# EasyEDA Pro project stm32-motordrive.epro, schematic Schematic1
Create Date: 2024-03-30; Page Name: P1; Project Name: motor-driver; Schematic Name: Schematic1; Update Date: 2024-03-31; Company: 嘉立创EDA; Page Size: A4; Version: V1.0
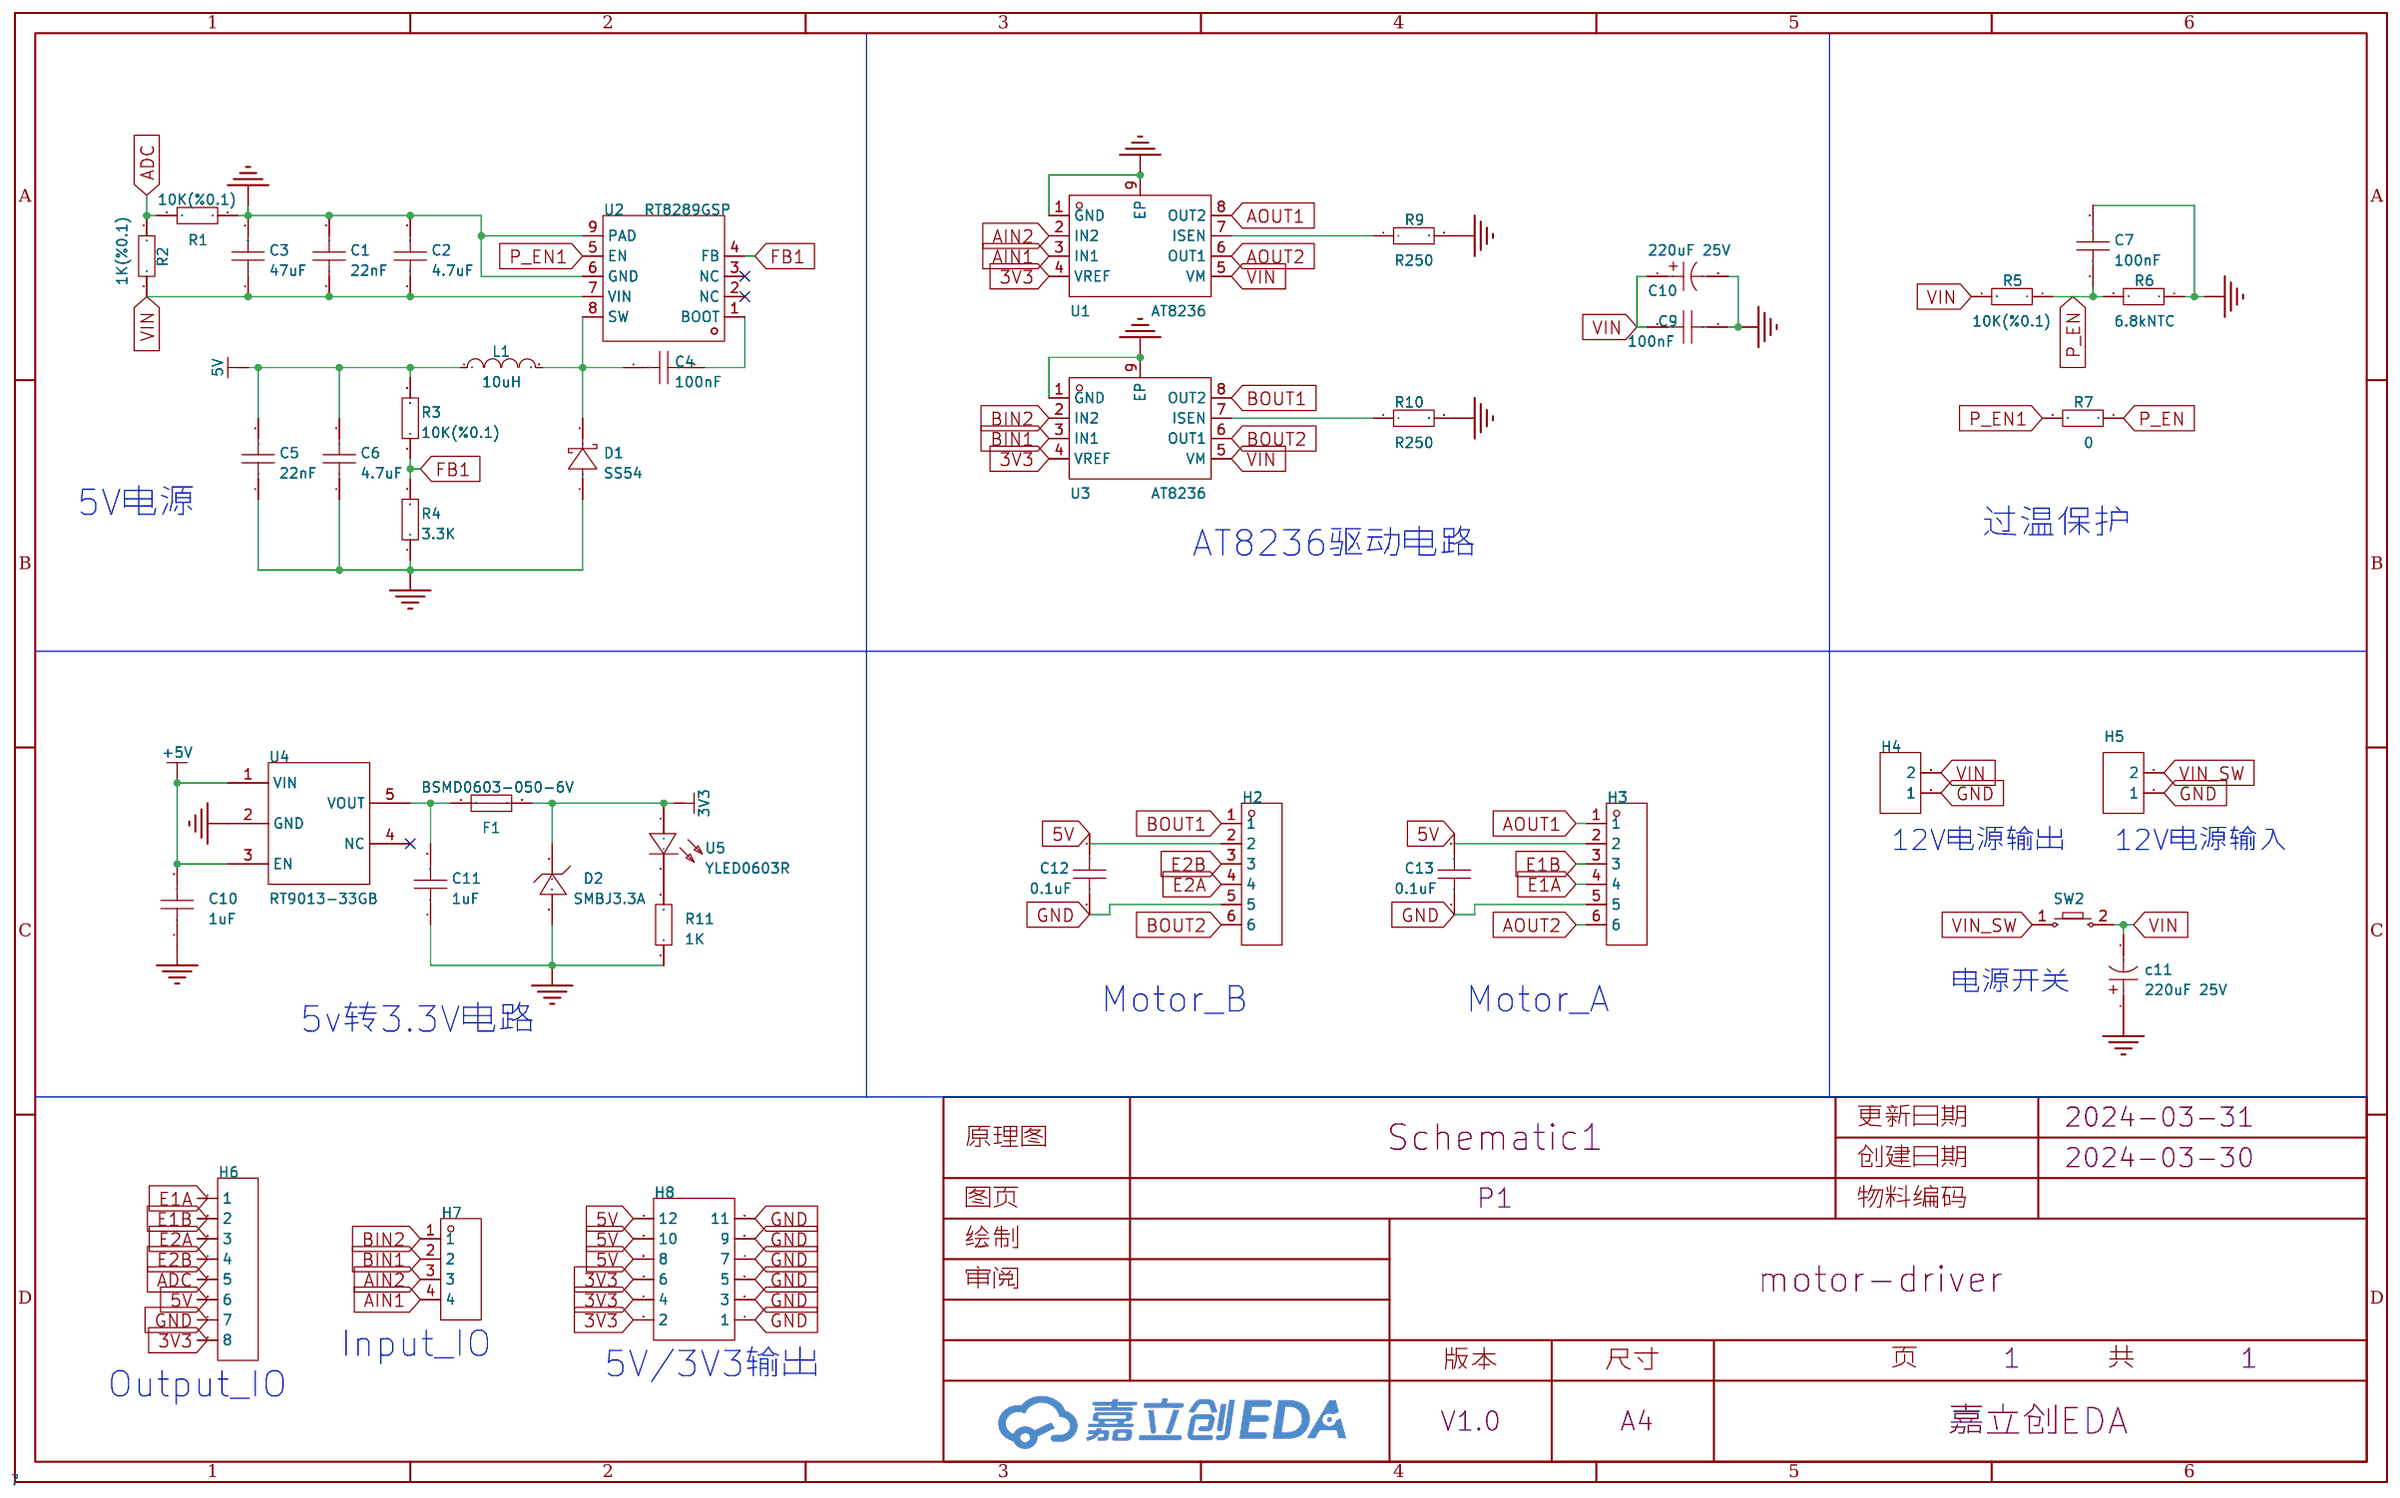
[diagram p0: schematic sheet]

## Parts
C1  22nF  [C0603]
C2  4.7uF  [C0603]
C3  47uF  [C0603]
C4  100nF  [C0603]
C5  22nF  [C0603]
C6  4.7uF  [C0603]
C7  100nF  [C0603]
C9  100nF  [C0603]
C10  220uF 25V  [CAP-SMD_BD6.3-L6.6-W6.6-LS7.2-FD]
C10#2  1uF  [C0603]
C11  1uF  [C0603]
c11  220uF 25V  [CAP-SMD_BD6.3-L6.6-W6.6-LS7.2-FD]
C12  0.1uF  [C0603]
C13  0.1uF  [C0603]
D1  SS54  [SMA_L4.3-W2.6-LS5.0-FD]
D2  SMBJ3.3A  [SMB_L4.6-W3.6-LS5.3-RD]
F1  BSMD0603-050-6V  [F0603]
H2  -  [HDR-TH_6P-P2.54-V-F]
H3  -  [HDR-TH_6P-P2.54-V-F]
H4  -  [HDR-TH_2P-P2.54-V-F]
H5  -  [HDR-TH_2P-P2.54-V-F]
H6  -  [HDR-TH_8P-P2.54-V-F-1]
H7  -  [HDR-TH_4P-P2.54-V-F]
H8  -  [HDR-TH_12P-P2.54-V-M-R2-C6-S2.54]
L1  10uH  [L0603]
R1  10K(%0.1)  [R0603]
R2  1K(%0.1)  [R0603]
R3  10K(%0.1)  [R0603]
R4  3.3K  [R0603]
R5  10K(%0.1)  [R0603]
R6  6.8kNTC  [R0603]
R7  0  [R0603]
R9  R250  [R0603]
R10  R250  [R0603]
R11  1K  [R0603]
SW2  -  [Key_SMD_3.6x6.1x2.5]
U1  AT8236  [ESOP-8_L4.9-W3.9-P1.27-LS6.0-BL-EP]
U2  RT8289GSP  [SOIC-8_L5.0-W4.0-P1.27-LS6.0-BL-EP2.0]
U3  AT8236  [ESOP-8_L4.9-W3.9-P1.27-LS6.0-BL-EP]
U4  RT9013-33GB  [SOT-23-5_L3.0-W1.7-P0.95-LS2.8-BL]
U5  YLED0603R  [LED0603-FD]

## Library data of the parts
C1-C7 C9 C10#2 C11-C13 = CAP_0603: Supplier Footprint: 0603
C10 c11 = RST220UF25V019: 容值:220uF;精度:±20%;额定电压:25V;纹波电流:165mA@120Hz;等效串联电阻:-;; LCSC Part Name: 220uF ±20% 25V; Supplier Part: C4747974; Manufacturer: KNSCHA(科尼盛); Supplier Footprint: SMD,D6.3xL7.7mm; JLCPCB Part Class: Extended Part; Datasheet: https://atta.szlcsc.com/upload/public/pdf/source/20220722/2E7F51AC9BE193B364DA1207D7353D66.pdf; Supplier: LCSC; Tolerance: ±20%; Rated Voltage: 25V; Ripple Current: 165mA@120Hz; φD: 6.3mm; L: 7.7mm; Lifetime @ Temp: 2000hrs@105℃; Operating Temperature: -40℃~+105℃
D1 = SS54_C7420369: 二极管配置:独立式;正向压降(Vf):550mV@5.0A;直流反向耐压(Vr):40V;平均整流电流(Io):5A;; LCSC Part Name: 电压:40V 电流:5A; Supplier Part: C7420369; Manufacturer: 宏迦橙; Supplier Footprint: SMA(DO-214AC); JLCPCB Part Class: 扩展库; Datasheet: https://atta.szlcsc.com/upload/public/pdf/source/20230828/254C3882F8647358AD9F60DD73611B5E.pdf; Supplier: LCSC; Diode Configuration: 独立式; Forward Voltage (Vf@If): 550mV@5.0A; Reverse Voltage (Vr): 40V; Average Rectified Current (Io): 5A; Reverse Leakage Current (Ir): 50uA@40V; Peak forward surge current: 120A
D2 = SMBJ3.3A_C362089: 反向截止电压(Vrwm):3.3V;最大钳位电压:7.3V;峰值脉冲功率(Ppp)@10/1000us:600W;击穿电压:4.1V;; LCSC Part Name: 单向TVS 3.3V截止 600W峰值脉冲功率; Supplier Part: C362089; Manufacturer: JKSEMI(金开盛); Supplier Footprint: SMB(DO-214AA); JLCPCB Part Class: 扩展库; Datasheet: https://atta.szlcsc.com/upload/public/pdf/source/20200731/C362089_3B984BF84356FE4A5051ADB3F5B1E766.pdf; Supplier: LCSC; Reverse Stand-Off Voltage (Vrwm): 3.3V; Maximum Clamping Voltage: 7.3V; Peak Pulse Power Dissipation (Ppp)@10/1000us: 600W; Breakdown Voltage: 4.1V; Type: TVS
F1 = BSMD0603-050-6V: 最大电压:6V;最大电流:40A;保持电流:500mA;跳闸电流:1A;; LCSC Part Name: 6V 500mA 0603自恢复; Supplier Part: C883095; Manufacturer: BHFUSE(佰宏); Supplier Footprint: 0603; JLCPCB Part Class: 扩展库; Datasheet: https://atta.szlcsc.com/upload/public/pdf/source/20230512/E478DE3555A0061DA0124A9F45802B86.pdf; Supplier: LCSC; Operating Voltage (Max): 6V; Current Rating (Max): 40A; Hold Current: 500mA; Trip Current: 1A; Power Dissipation: 500mW; Resistance - Initial (Ri) (Min): 100mΩ; Resistance - Post Trip (R1) (Max): 800mΩ; Maximum Time to Trip: 100ms; Operating Temperature: -40℃~+85℃
H2 H3 = HDR-F_2.54_1x6P: Supplier Part: C40877; Supplier Footprint: 插件
H4 H5 = HDR-F_2.54_1x2P: Supplier Part: C49661; Supplier Footprint: 插件
H6 = HDR-F_2.54_1x8P: Supplier Part: C27438; Supplier Footprint: 插件
H7 = HDR-F_2.54_1x4P: Supplier Part: C2718488; Supplier Footprint: 插件
H8 = HDR-F_2.54_2x6: Supplier Part: C92270; Supplier Footprint: 插件
L1 = L_0603
R1-R7 R9-R11 = Res_0603: Supplier Footprint: 0603
SW2 = Key_SMD_3.6x6.1x2.5: Supplier Footprint: SMD
U1 U3 = AT8236: Supplier Part: C2827823; Manufacturer: 杭州中科微; Supplier Footprint: ESOP-8; JLCPCB Part Class: 扩展库; Datasheet: https://atta.szlcsc.com/upload/public/pdf/source/20210923/1552D95CBAF8BE780D06AE79E7783380.pdf; Supplier: LCSC
U2 = RT8289GSP: 功能类型:降压型;输出类型:可调;输入电压:5.5V~32V;输出电压:1.222V~26V;输出电流(最大值):5A;; Supplier Part: C39202; Manufacturer: RICHTEK(立锜); Supplier Footprint: SOIC-8-EP; JLCPCB Part Class: 扩展库; Datasheet: https://atta.szlcsc.com/upload/public/pdf/source/20141219/1457707253176.pdf; Supplier: LCSC; Function: 降压型; Output Type: 可调; Input Voltage: 5.5V~32V; Output Voltage: 1.222V~26V; Output Current (Max): 5A; Switching Frequency: 500kHz; Operating Temperature: -40℃~+85℃@(TA); Synchronous Rectification: 否; Number of Outputs: 1; Topology: 降压式; Switch tube (built-in/external): 内置
U4 = RT9013-33GB: 输出类型:固定;最大输入电压:5.5V;输出电压:3.3V;最大输出电流:500mA;电源纹波抑制比(PSRR):50dB@(10kHz);输出极性:正极;; LCSC Part Name: 输入5.5V 输出3.3V 500mA; Supplier Part: C47773; Manufacturer: RICHTEK(立锜); Supplier Footprint: SOT-23-5; JLCPCB Part Class: 扩展库; Datasheet: https://atta.szlcsc.com/upload/public/pdf/source/20150504/1457707282459.pdf; Supplier: LCSC; Output Type: 固定; Maximum Input Voltage: 5.5V; Output Voltage: 3.3V; MAX Output Current: 500mA; Power Supply Rejection Ratio (PSRR): 50dB@(10kHz); Dropout Voltage: 400mV@(500mA); standby current: 50uA; Operating Temperature: -40℃~+85℃; Output Polarity: 正极; Number of Outputs: 1
U5 = YLED0603R: 发光颜色:红色;正向电压(VF):1.8V~2.4V;功率:-;正向电流:25mA;主波长:620nm~625nm;二极管配置:-;透镜颜色:-;色温:-;发光强度:-;发光角度:-;载带方式:-;工作温度:-40℃~+85℃;; Supplier Part: C19171390; Manufacturer: YONGYUTAI(永裕泰); Supplier Footprint: 0603; JLCPCB Part Class: 扩展库; Datasheet: https://atta.szlcsc.com/upload/public/pdf/source/20231027/FB19AF06E2C70028E58AB5CEDD1BDC72.pdf; Supplier: LCSC; Emitted Color: 红色; Forward Voltage (VF): 1.8V~2.4V; Forward Current: 25mA; Dominant Wavelength: 620nm~625nm; Operating Temperature: -40℃~+85℃

## Nets
3V3: D2.1 F1.2 H6.8 H8.2 H8.4 H8.6 U1.4(VREF) U3.4(VREF) U5.1(+)
5V: C5.2 C6.2 C12.2 C13.2 H2.2 H3.2 H6.6 H8.8 H8.10 H8.12 L1.1 R3.2
+5V: C10#2.2 U4.1(VIN) U4.3(EN)
GND: C1.2 C2.2 C3.2 C5.1 C6.1 C7.2 C9.1 C10.2 C10#2.1 C11.1 c11.1 C12.1 C13.1 D1.1(A) D2.2 H2.5 H3.5 H4.1 H5.1 H6.7 H8.1 H8.3 H8.5 H8.7 H8.9 H8.11 R1.1 R4.1 R6.1 R9.2 R10.2 R11.1 U1.1(GND) U1.9(EP) U2.6(GND) U2.9(PAD) U3.1(GND) U3.9(EP) U4.2(GND)
VIN: C1.1 C2.1 C3.1 C9.2 C10.1 c11.2 H4.2 R2.1 R5.2 SW2.2 U1.5(VM) U2.7(VIN) U3.5(VM)
VIN_SW: H5.2 SW2.1
ADC: H6.5 R1.2 R2.2
AIN1: H7.4 U1.3(IN1)
AIN2: H7.3 U1.2(IN2)
AOUT1: H3.1 U1.8(OUT2)
AOUT2: H3.6 U1.6(OUT1)
BIN1: H7.2 U3.3(IN1)
BIN2: H7.1 U3.2(IN2)
BOUT1: H2.1 U3.8(OUT2)
BOUT2: H2.6 U3.6(OUT1)
E1A: H3.4 H6.1
E1B: H3.3 H6.2
E2A: H2.4 H6.3
E2B: H2.3 H6.4
FB1: R3.1 R4.2 U2.4(FB)
P_EN: C7.1 R5.1 R6.2 R7.1
P_EN1: R7.2 U2.5(EN)
Net-(C4-1): C4.1 D1.2(K) L1.2 U2.8(SW)
Net-(C4-2): C4.2 U2.1(BOOT)
Net-(C11-2): C11.2 F1.1 U4.5(VOUT)
Net-(R9-1): R9.1 U1.7(ISEN)
Net-(R10-1): R10.1 U3.7(ISEN)
Net-(R11-2): R11.2 U5.2(-)

Not connected (* = marked no-connect by the designer): U2 2(NC)* 3(NC)*; U4 4(NC)*

## Notes on the sheet
- 5V电源
- 过温保护
- AT8236驱动电路
- 12V电源输出
- 12V电源输入
- 电源开关
- Motor_B
- Motor_A
- 5v转3.3V电路
- Input_IO
- 5V/3V3输出
- Output_IO
